# EAGLE design Diagrama_primário (EAGLE 9.4.2)
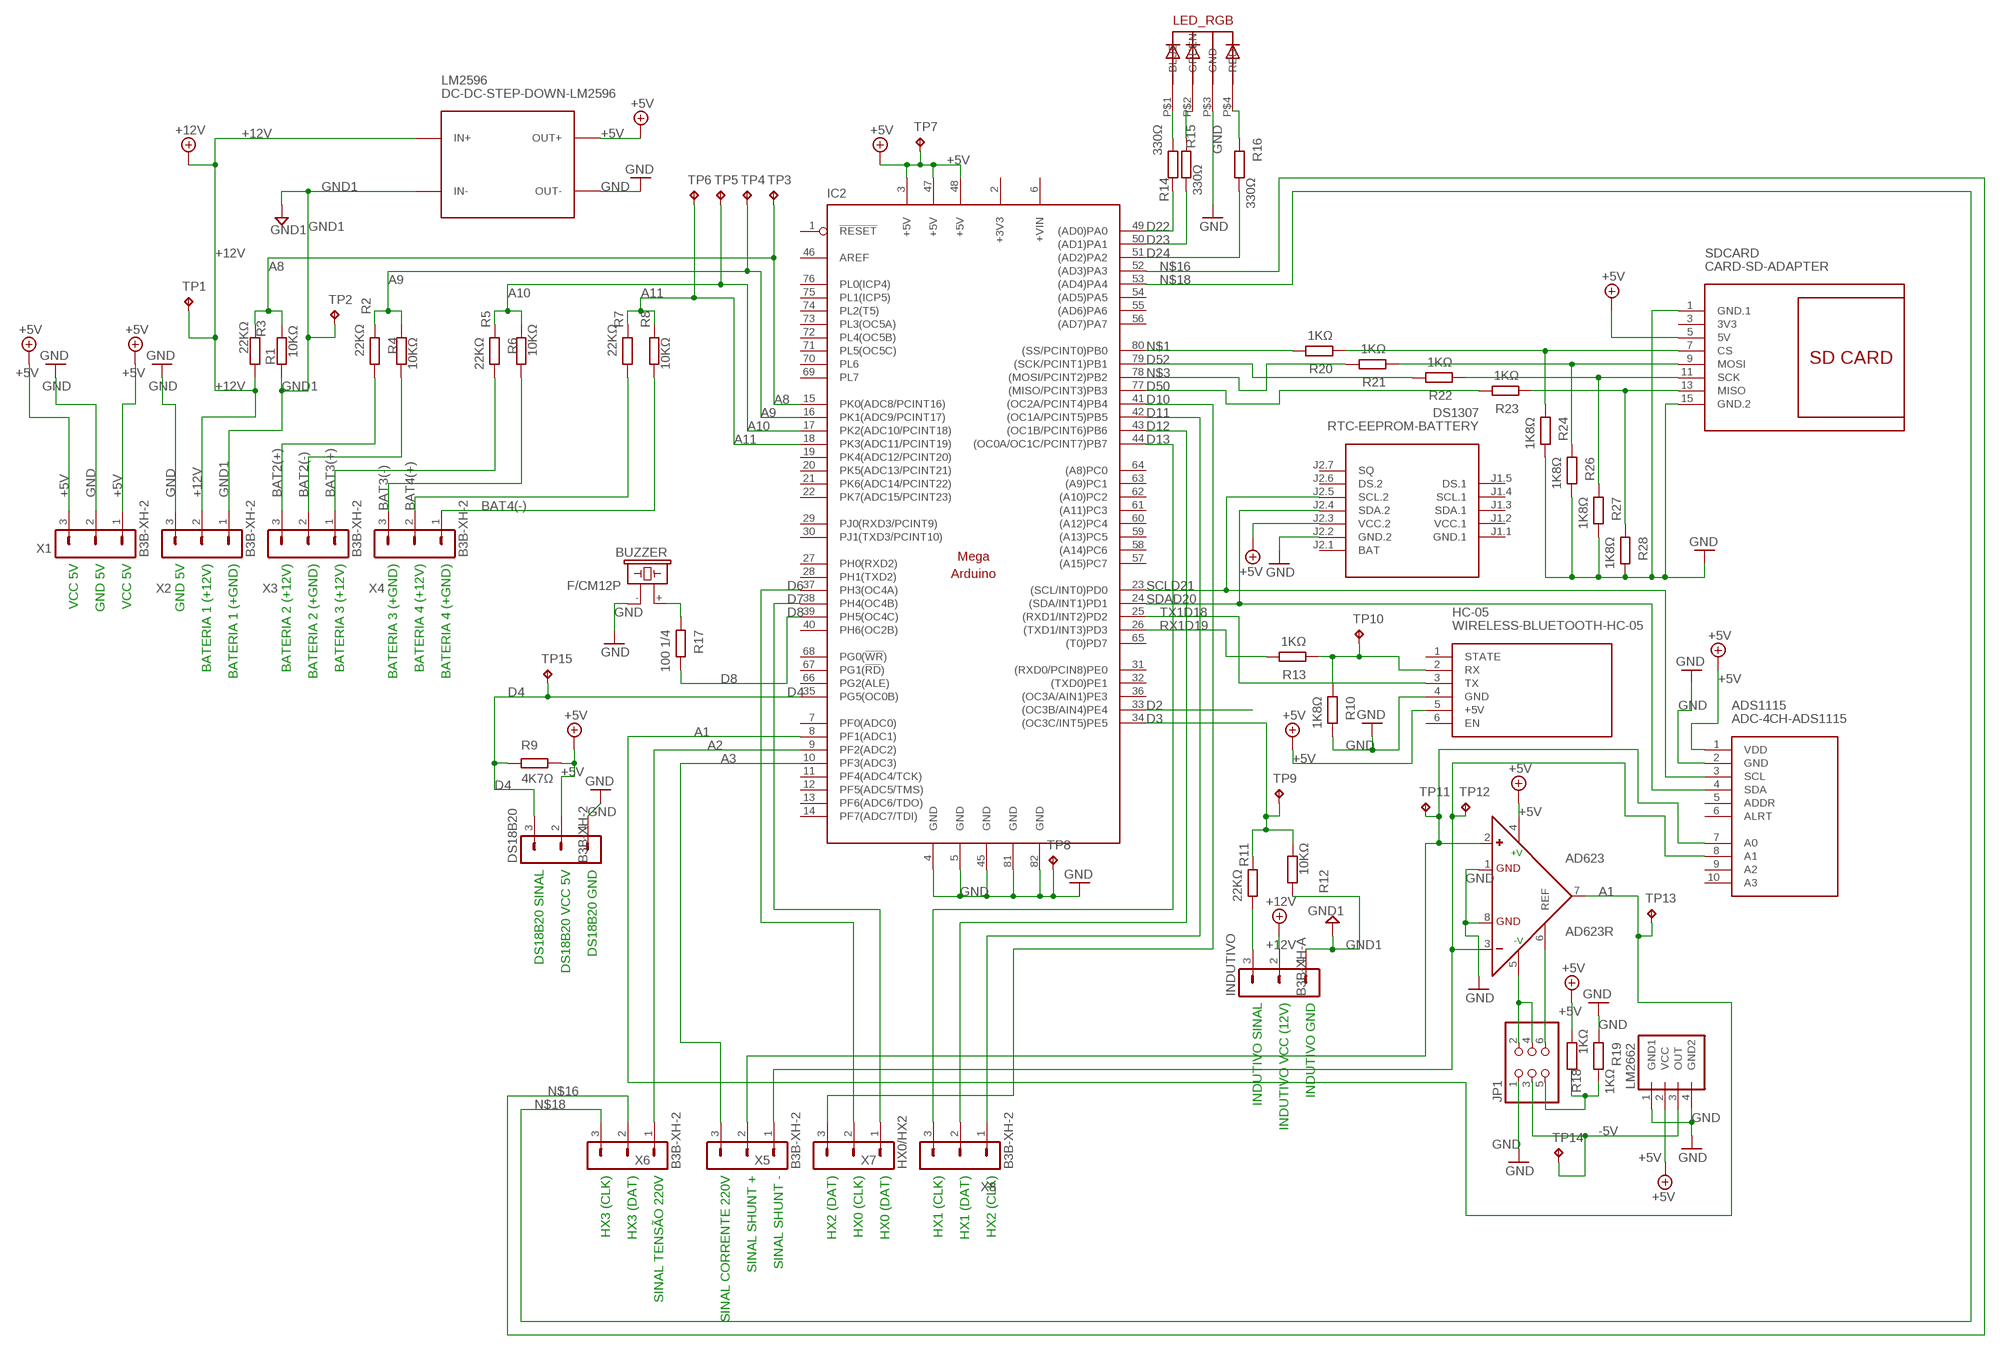
[diagram p0: schematic, sheet 1]

## Parts
AD623  AD623R  [SO8]
ADS1115  ADC-4CH-ADS1115  [ADC-4CH-ADS1115]
BUZZER  F/CM12P  [F/CM12P]
DS18B20  B3B-XH-2  [B3B-XH-A]
DS1307  RTC-EEPROM-BATTERY  [RTC-EEPROM-BATTERY]
HC-05  WIRELESS-BLUETOOTH-HC-05  [WIRELESS-BLUETOOTH-HC-05]
IC2  MEGAARDUINO_11  [MEGA_ARDUINO_1]
INDUTIVO  B3B-XH-A  [B3B-XH-A]
JP1  PINHD-2X3  [2X03]
LED_RGB  5MMRGBLED  [LED5MMRGB]
LM2596  DC-DC-STEP-DOWN-LM2596  [DC-DC-STEP-DOWN-LM2596]
LM2662  LM2662  [LM2662]
R1  10KΩ  1K1/4RESISTOR  [1/4W-0.41K]
R2  22KΩ  1K1/4RESISTOR  [1/4W-0.41K]
R3  22KΩ  1K1/4RESISTOR  [1/4W-0.41K]
R4  10KΩ  1K1/4RESISTOR  [1/4W-0.41K]
R5  22KΩ  1K1/4RESISTOR  [1/4W-0.41K]
R6  10KΩ  1K1/4RESISTOR  [1/4W-0.41K]
R7  22KΩ  1K1/4RESISTOR  [1/4W-0.41K]
R8  10KΩ  1K1/4RESISTOR  [1/4W-0.41K]
R9  4K7Ω  1K1/4RESISTOR  [1/4W-0.41K]
R10  1K8Ω  1K1/4RESISTOR  [1/4W-0.41K]
R11  22KΩ  1K1/4RESISTOR  [1/4W-0.41K]
R12  10KΩ  1K1/4RESISTOR  [1/4W-0.41K]
R13  1KΩ  1K1/4RESISTOR  [1/4W-0.41K]
R14  330Ω  1K1/4RESISTOR  [1/4W-0.41K]
R15  330Ω  1K1/4RESISTOR  [1/4W-0.41K]
R16  330Ω  1K1/4RESISTOR  [1/4W-0.41K]
R17  100 1/4  1K1/4RESISTOR  [1/4W-0.41K]
R18  1KΩ  1K1/4RESISTOR  [1/4W-0.41K]
R19  1KΩ  1K1/4RESISTOR  [1/4W-0.41K]
R20  1KΩ  1K1/4RESISTOR  [1/4W-0.41K]
R21  1KΩ  1K1/4RESISTOR  [1/4W-0.41K]
R22  1KΩ  1K1/4RESISTOR  [1/4W-0.41K]
R23  1KΩ  1K1/4RESISTOR  [1/4W-0.41K]
R24  1K8Ω  1K1/4RESISTOR  [1/4W-0.41K]
R26  1K8Ω  1K1/4RESISTOR  [1/4W-0.41K]
R27  1K8Ω  1K1/4RESISTOR  [1/4W-0.41K]
R28  1K8Ω  1K1/4RESISTOR  [1/4W-0.41K]
SDCARD  CARD-SD-ADAPTER  [CARD-SD-ADAPTER]
TP1  TPB1,27  [B1,27]
TP2  TPB1,27  [B1,27]
TP3  TPB1,27  [B1,27]
TP4  TPB1,27  [B1,27]
TP5  TPB1,27  [B1,27]
TP6  TPB1,27  [B1,27]
TP7  TPB1,27  [B1,27]
TP8  TPB1,27  [B1,27]
TP9  TPB1,27  [B1,27]
TP10  TPB1,27  [B1,27]
TP11  TPB1,27  [B1,27]
TP12  TPB1,27  [B1,27]
TP13  TPB1,27  [B1,27]
TP14  TPB1,27  [B1,27]
TP15  TPB1,27  [B1,27]
X1  B3B-XH-2  [B3B-XH-A]
X2  B3B-XH-2  [B3B-XH-A]
X3  B3B-XH-2  [B3B-XH-A]
X4  B3B-XH-2  [B3B-XH-A]
X5  B3B-XH-2  [B3B-XH-A]
X6  B3B-XH-2  [B3B-XH-A]
X7  HX0/HX2  B3B-XH-2  [B3B-XH-A]
X8  B3B-XH-2  [B3B-XH-A]

## Nets
+5V: AD623.4(+V) ADS1115.1(VDD) DS18B20.2 DS1307.J2.3(VCC.2) HC-05.5(+5V) IC2.3(+5V) IC2.47(+5V) IC2.48(+5V) LM2596.OUT+ LM2662.2(VCC) R9.2 R18.1 SDCARD.5(5V) TP7.TP X1.1 X1.3
+12V: INDUTIVO.2 LM2596.IN+ R3.2 TP1.TP X2.2
-5V: JP1.3 LM2662.3(OUT) TP14.TP
A1: AD623.7(OUT) IC2.8(PF1(ADC1)) TP13.TP
A2: IC2.9(PF2(ADC2)) X6.1
A3: IC2.10(PF3(ADC3)) X5.3
A8: IC2.15(PK0(ADC8/PCINT16)) R1.1 R3.1 TP3.TP
A9: IC2.16(PK1(ADC9/PCINT17)) R2.1 R4.1 TP4.TP
A10: IC2.17(PK2(ADC10/PCINT18)) R5.1 R6.1 TP5.TP
A11: IC2.18(PK3(ADC11/PCINT19)) R7.1 R8.1 TP6.TP
BAT2(+): R2.2 X3.3
BAT2(-): R4.2 X3.2
BAT3(+): R5.2 X3.1
BAT3(-): R6.2 X4.3
BAT4(+): R7.2 X4.2
BAT4(-): R8.2 X4.1
D2: IC2.33((OC3B/AIN4)PE4)
D3: IC2.34((OC3C/INT5)PE5) R11.1 R12.1 TP9.TP
D4: DS18B20.3 IC2.35(PG5(OC0B)) R9.1 TP15.TP
D6: IC2.37(PH3(OC4A)) X7.2
D7: IC2.38(PH4(OC4B)) X7.1
D8: IC2.39(PH5(OC4C)) R17.2
D10: IC2.41((OC2A/PCINT4)PB4) X7.3
D11: IC2.42((OC1A/PCINT5)PB5) X8.1
D12: IC2.43((OC1B/PCINT6)PB6) X8.2
D13: IC2.44((OC0A/OC1C/PCINT7)PB7) X8.3
D22: IC2.49((AD0)PA0) R14.2
D23: IC2.50((AD1)PA1) R15.2
D24: IC2.51((AD2)PA2) R16.2
D50: IC2.77((MISO/PCINT3)PB3) R23.2
D51: R21.1 R26.1 SDCARD.9(MOSI)
D52: IC2.79((SCK/PCINT1)PB1) R22.2
D53: R20.1 R24.1 SDCARD.7(CS)
GND: AD623.1(RG) AD623.8(RG) ADS1115.2(GND) BUZZER.- DS18B20.1 DS1307.J2.2(GND.2) HC-05.4(GND) IC2.4(GND) IC2.5(GND) IC2.45(GND) IC2.81(GND) IC2.82(GND) JP1.1 LED_RGB.P$3(GND) LM2596.OUT- LM2662.1(GND1) LM2662.4(GND2) R10.2 R19.1 R24.2 R26.2 R27.2 R28.2 SDCARD.1(GND.1) SDCARD.15(GND.2) TP8.TP X1.2 X2.3
GND1: INDUTIVO.1 LM2596.IN- R1.2 R12.2 TP2.TP X2.1
N$1: IC2.80((SS/PCINT0)PB0) R20.2
N$2: INDUTIVO.3 R11.2
N$3: IC2.78((MOSI/PCINT2)PB2) R21.2
N$8: HC-05.2(RX) R10.1 R13.1 TP10.TP
N$11: LED_RGB.P$1(BLUE) R14.1
N$12: LED_RGB.P$2(GREEN) R15.1
N$13: LED_RGB.P$4(RED) R16.1
N$14: R22.1 R27.1 SDCARD.11(SCK)
N$15: R23.1 R28.1 SDCARD.13(MISO)
N$16: IC2.52((AD3)PA3) X6.2
N$17: BUZZER.+ R17.1
N$18: IC2.53((AD4)PA4) X6.3
N$25: AD623.3(-) ADS1115.8(A1) TP12.TP X5.1
N$26: AD623.2(+) ADS1115.7(A0) TP11.TP X5.2
N$27: AD623.5(-V) JP1.2 JP1.4
N$28: AD623.6(REF) JP1.6
RX1D19: IC2.26((TXD1/INT3)PD3) R13.2
SCLD21: ADS1115.3(SCL) DS1307.J2.5(SCL.2) IC2.23((SCL/INT0)PD0)
SDAD20: ADS1115.4(SDA) DS1307.J2.4(SDA.2) IC2.24((SDA/INT1)PD1)
TX1D18: HC-05.3(TX) IC2.25((RXD1/INT2)PD2)
VCC1: JP1.5 R18.2 R19.2
Unconnected: ADS1115.5(ADDR) ADS1115.6(ALRT) ADS1115.9(A2) ADS1115.10(A3) DS1307.J1.3(SDA.1) DS1307.J1.4(SCL.1) DS1307.J1.5(DS.1) DS1307.J2.1(BAT) DS1307.J2.6(DS.2) DS1307.J2.7(SQ) HC-05.1(STATE) HC-05.6(EN) IC2.1(!RESET) IC2.7(PF0(ADC0)) IC2.11(PF4(ADC4/TCK)) IC2.12(PF5(ADC5/TMS)) IC2.13(PF6(ADC6/TDO)) IC2.14(PF7(ADC7/TDI)) IC2.19(PK4(ADC12/PCINT20)) IC2.20(PK5(ADC13/PCINT21)) IC2.21(PK6(ADC14/PCINT22)) IC2.22(PK7(ADC15/PCINT23)) IC2.27(PH0(RXD2)) IC2.28(PH1(TXD2)) IC2.29(PJ0(RXD3/PCINT9)) IC2.30(PJ1(TXD3/PCINT10)) IC2.31((RXD0/PCIN8)PE0) IC2.32((TXD0)PE1) IC2.36((OC3A/AIN1)PE3) IC2.40(PH6(OC2B)) IC2.46(AREF) IC2.54((AD5)PA5) IC2.55((AD6)PA6) IC2.56((AD7)PA7) IC2.57((A15)PC7) IC2.58((A14)PC6) IC2.59((A13)PC5) IC2.60((A12)PC4) IC2.61((A11)PC3) IC2.62((A10)PC2) IC2.63((A9)PC1) IC2.64((A8)PC0) IC2.65((T0)PD7) IC2.66(PG2(ALE)) IC2.67(PG1(!RD!)) IC2.68(PG0(!WR!)) IC2.69(PL7) IC2.70(PL6) IC2.71(PL5(OC5C)) IC2.72(PL4(OC5B)) IC2.73(PL3(OC5A)) IC2.74(PL2(T5)) IC2.75(PL1(ICP5)) IC2.76(PL0(ICP4))

## Notes on the sheet
- VCC 5V | GND 5V | VCC 5V | GND 5V | BATERIA 1 (+12V) | BATERIA 1 (+GND) | BATERIA 2 (+12V) | BATERIA 2 (+GND) | BATERIA 3 (+12V) | BATERIA 3 (+GND) | BATERIA 4 (+12V) | BATERIA 4 (+GND)
- DS18B20 SINAL | DS18B20 VCC 5V | DS18B20 GND
- INDUTIVO SINAL | INDUTIVO VCC (12V) | INDUTIVO GND
- HX3 (CLK) | HX3 (DAT) | SINAL TENSÃO 220V | SINAL CORRENTE 220V | SINAL SHUNT + | SINAL SHUNT - | HX2 (DAT) | HX0 (CLK) | HX0 (DAT) | HX1 (CLK) | HX1 (DAT) | HX2 (CLK)

## Power pins joined to a net without a drawn wire
3V3: SDCARD.3(3V3)
+3V3: IC2.2(+3V3)
+VIN: IC2.6(+VIN)
GND.1: DS1307.J1.1(GND.1)
VCC.1: DS1307.J1.2(VCC.1)

## Library data of the parts
AD623 = minha biblioteca:AD623: Single-Supply, Rail-to-Rail, Low Cost Instrumentation Amplifier Source: http://www.analog.com/static/imported-files/data_sheets/AD623.pdf; MPN: AD623ARZ.; OC_FARNELL: 9426213; OC_NEWARK: 31M4186
ADS1115 = diy-modules:ADC-4CH-ADS1115: 4 Channel 16-Bit Analog-to-Digital Converter based on ADS1115 chip Arduino ADS1115 Getting Started Tutorial is available here: http://henrysbench.capnfatz.com/henrys-bench/arduino-voltage-measurements/arduino-ads1115-module-getting-started-tutorial/ ADS1115 datasheet is available here: http://www.ti.com/lit/ds/symlink/ads1115.pdf Click here to find device on ebay.com <http://www.ebay.com/sch/ads1115+module>
BUZZER = buzzer:F/CM12P: BUZZER Source: Buerklin; OC_FARNELL: unknown; OC_NEWARK: unknown
DS18B20 INDUTIVO X1-X8 = con-JST XH:B3B-XH: JST XH series header 2.50mm pitch disconnectable crimp style connectors, vertical (side entry type), 3 pins
DS1307 = diy-modules:RTC-EEPROM-BATTERY: RTC Module with Battery and EEPROM based on DS1307 and AT24C32 chips More details available here: http://henrysbench.capnfatz.com/henrys-bench/arduino-sensors-and-input/arduino-tiny-rtc-d1307-tutorial/ Click here to find device on ebay.com <http://www.ebay.com/sch/tiny+rtc+arduino>
HC-05 = diy-modules:WIRELESS-BLUETOOTH-HC-05: Bluetooth Transceiver Module based on HC-05 board Tutorial is available here: https://arduino-info.wikispaces.com/BlueTooth-HC05-HC06-Modules-How-To Click here to find device on ebay.com <http://www.ebay.com/sch/hc-05+module+rs232>
IC2 = minha biblioteca:MEGAARDUINO_1: The Arduino Mega is a microcontroller board based on the ATmega1280. - 54 digital input/output pins (of which 14 can be used as PWM outputs) - 16 analog inputs - 4 UARTs (hardware serial ports) - 16 MHz crystal oscillator - USB connection - power jack - ICSP header - reset button It contains everything needed to support the microcontroller; simply connect it to a computer with a USB cable or power it with a AC-to-DC adapter or battery to get started. The Mega is compatible with most shields designed for the Arduino Duemilanove or Diecimila. http://arduino.cc/en/Main/ArduinoBoardMega
JP1 = pinhead:PINHD-2X3: PIN HEADER
LED_RGB = minha biblioteca:5MMRGBLED
LM2596 = diy-modules:DC-DC-STEP-DOWN-LM2596: DC/DC Step-Down Regulator based on LM2596-ADJ chip LM2596 datasheet available here: http://www.ti.com/lit/ds/symlink/lm2596.pdf Click here to find device on ebay.com <http://www.ebay.com/sch/lm2596+power+regulator>
LM2662 = minha biblioteca:LM2662: PIN HEADER
R1-R24 R26-R28 = resistors:1K1/4RESISTOR
SDCARD = diy-modules:CARD-SD-ADAPTER: Full Size SD Card Adapter Module with onboard 3.3V regulator Guide describing how to use SD card with Arduino is available here: https://www.arduino.cc/en/Reference/SDCardNotes Click here to find device on ebay.com <http://www.ebay.com/sch/sd+card+socket+module>
TP1-TP15 = testpad:TP: Test pad

## Board
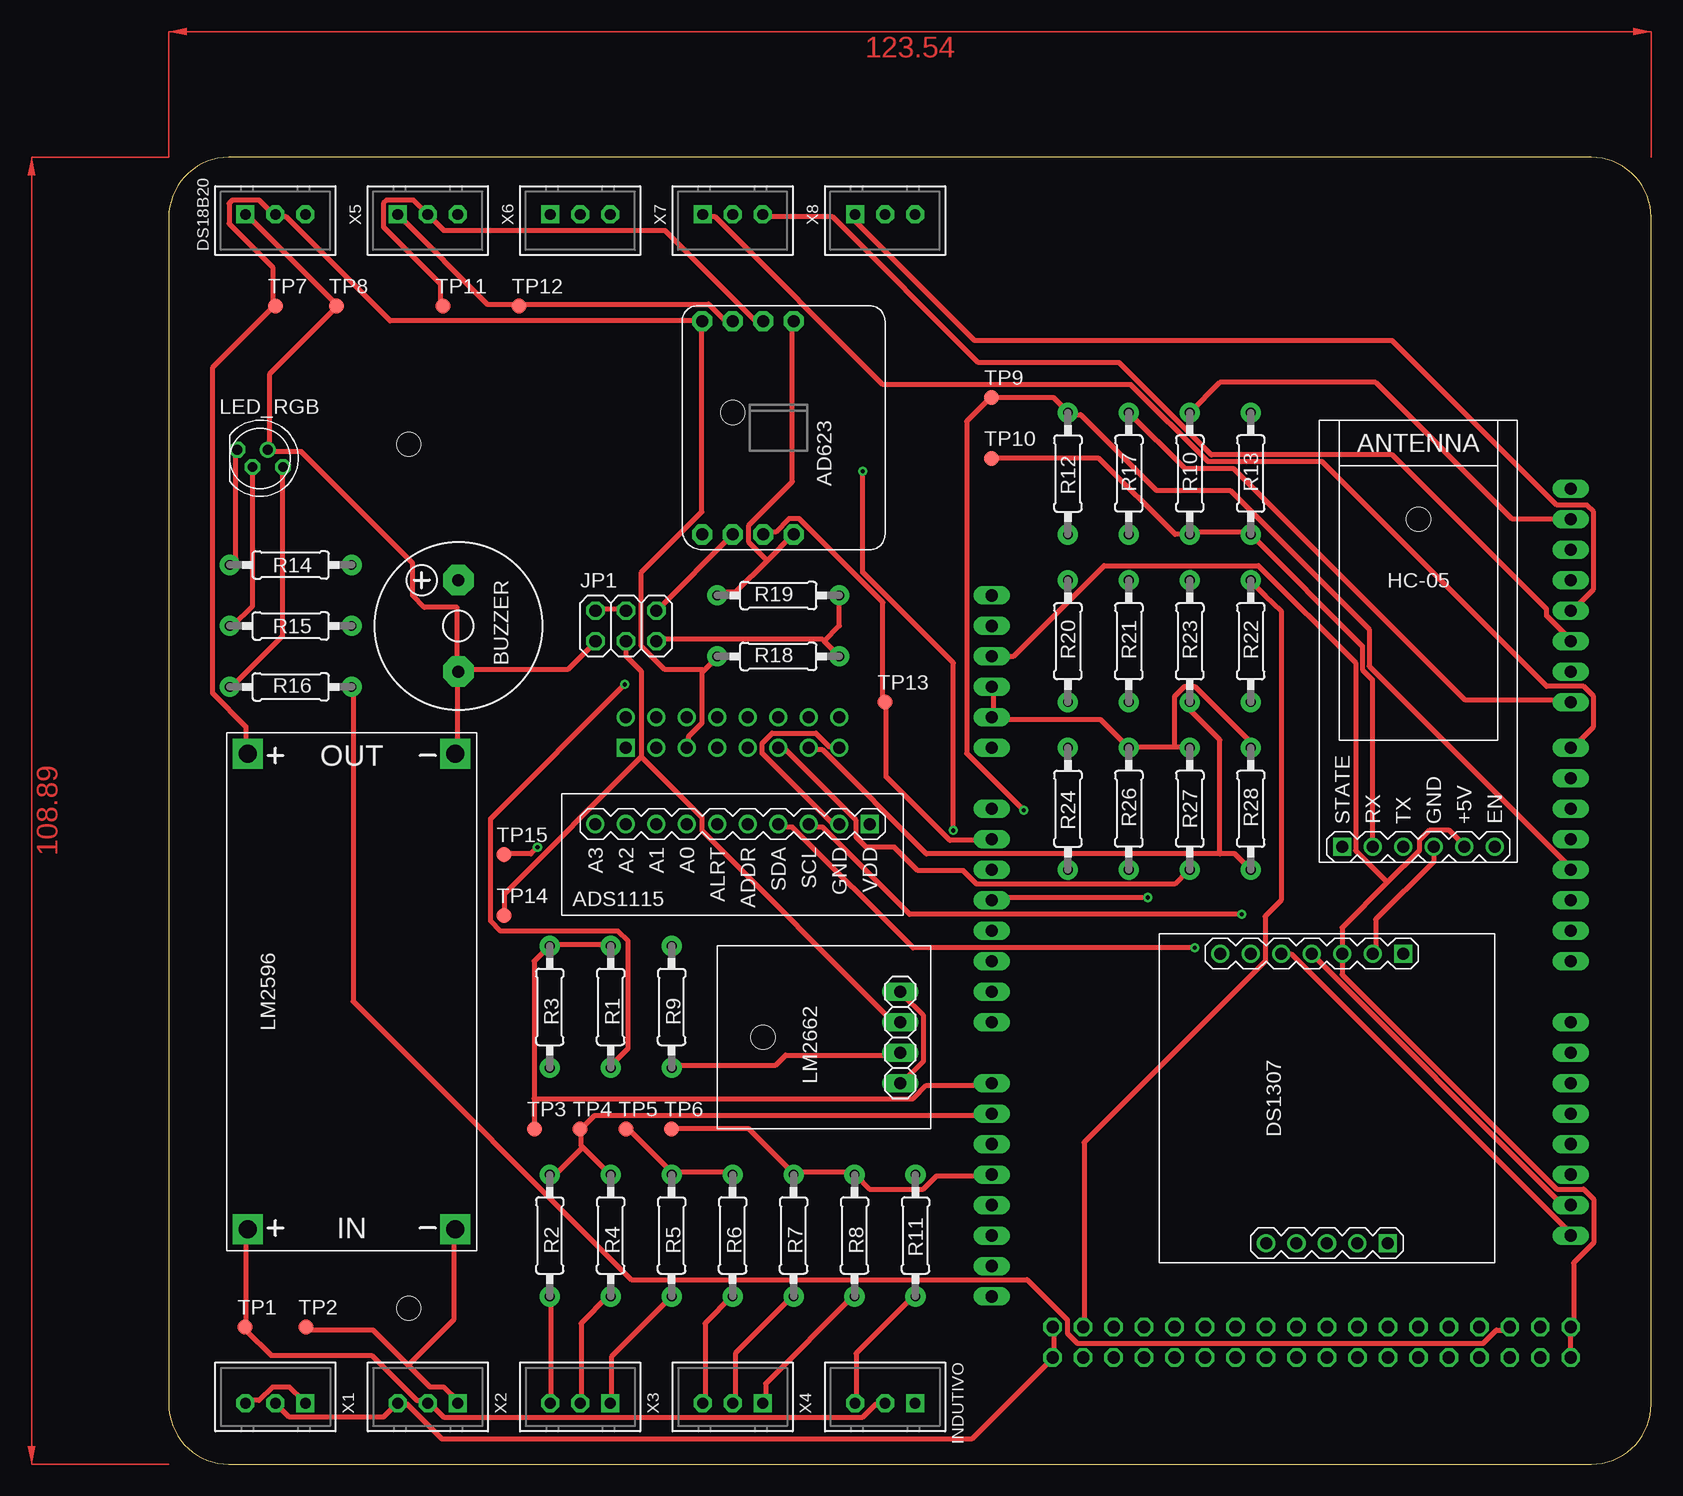
[diagram p1: board, top side]
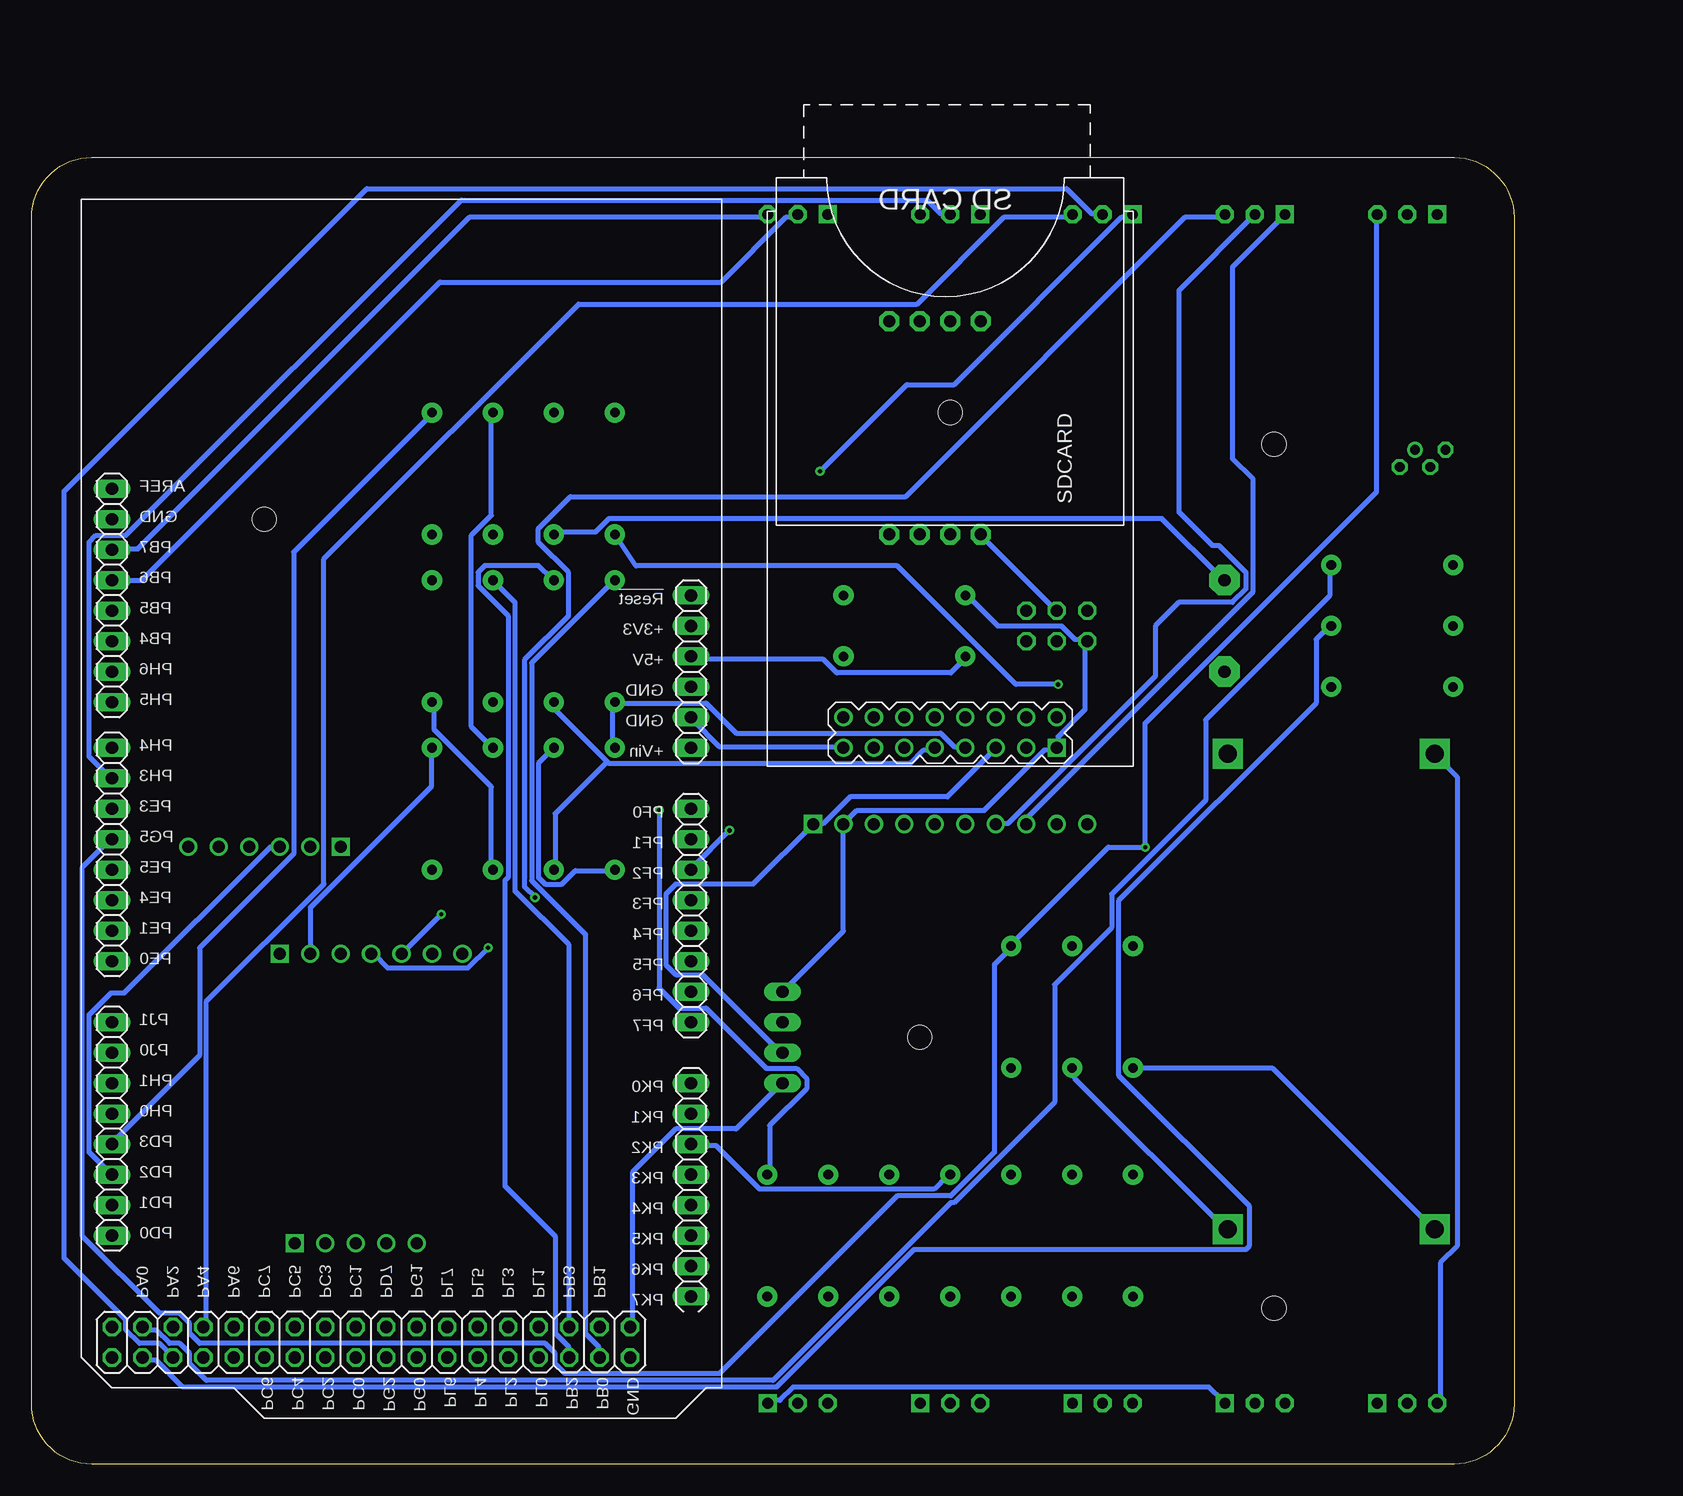
[diagram p2: board, bottom side, seen from below]

Size 123.54 x 108.89 mm. Coordinates in mm from the lower left corner, seen from the top.
Outline: 0,103.89 0,5 arc90 5,0 118.54,0 arc90 123.54,5 123.54,103.89 arc90 118.54,108.89 5,108.89 arc90 0,103.89
Copper layers (1*16): Top 0.035mm / dielectric 1.5mm / Bottom 0.035mm
Design rules "default *": minimum track width 16mil, minimum drill 0.35mm, track to track 6mil, track to pad 6mil, pad to pad 6mil, via to via 6mil, smd to smd 6mil, copper to edge 40mil, drill to drill 6mil, minimum pad ring 10mil, minimum via ring 8mil, stop-mask expansion 4mil, vias tented up to drill 0mil, thermal gap 10mil
Holes 2 mm at 20,85 20,13

### Footprints (pad centres in the part's own frame; a part is rotated, then mirrored left to right if it is on the bottom)
SO8 = drill 1 pad 1.676 octagon: 1 -1.27,-10.16; 2 1.27,-10.16; 3 3.81,-10.16; 4 6.35,-10.16; 5 6.35,7.62; 6 3.81,7.62; 7 1.27,7.62; 8 -1.27,7.62
ADC-4CH-ADS1115 = drill 1 square: 1 -6.35,11.43 | drill 1: 2 -6.35,8.89; 3 -6.35,6.35; 4 -6.35,3.81; 5 -6.35,1.27; 6 -6.35,-1.27; 7 -6.35,-3.81; 8 -6.35,-6.35; 9 -6.35,-8.89; 10 -6.35,-11.43
F/CM12P = drill 1.016 pad 2.54 octagon: + 3.81,0; - -3.81,0
B3B-XH-A = drill 0.9 pad 1.5 square: 1 2.5,0 | drill 0.9 pad 1.5 octagon: 2 0,0; 3 -2.5,0
RTC-EEPROM-BATTERY = drill 1 square: J1.1 -12.065,-5.08; J2.1 12.065,-6.35 | drill 1: J1.2 -12.065,-2.54; J1.3 -12.065,0; J1.4 -12.065,2.54; J1.5 -12.065,5.08; J2.2 12.065,-3.81; J2.3 12.065,-1.27; J2.4 12.065,1.27; J2.5 12.065,3.81; J2.6 12.065,6.35; J2.7 12.065,8.89
WIRELESS-BLUETOOTH-HC-05 = drill 1 square: 1 -6.35,-17.145 | drill 1: 2 -3.81,-17.145; 3 -1.27,-17.145; 4 1.27,-17.145; 5 3.81,-17.145; 6 6.35,-17.145 | hole 2: 0,10.16
MEGA_ARDUINO_1 = drill 1.016 long: 1 33.02,2.54; 2 35.56,2.54; 3 38.1,2.54; 4 40.64,2.54; 5 43.18,2.54; 6 45.72,2.54; 7 50.8,2.54; 8 53.34,2.54; 9 55.88,2.54; 10 58.42,2.54; 11 60.96,2.54; 12 63.5,2.54; 13 66.04,2.54; 14 68.58,2.54; 15 73.66,2.54; 16 76.2,2.54; 17 78.74,2.54; 18 81.28,2.54; 19 83.82,2.54; 20 86.36,2.54; 21 88.9,2.54; 22 91.44,2.54; 23 86.36,50.8; 24 83.82,50.8; 25 81.28,50.8; 26 78.74,50.8; 27 76.2,50.8; 28 73.66,50.8; 29 71.12,50.8; 30 68.58,50.8; 31 63.5,50.8; 32 60.96,50.8; 33 58.42,50.8; 34 55.88,50.8; 35 53.34,50.8; 36 50.8,50.8; 37 48.26,50.8; 38 45.72,50.8; 39 41.91,50.8; 40 39.37,50.8; 41 36.83,50.8; 42 34.29,50.8; 43 31.75,50.8; 44 29.21,50.8; 45 26.67,50.8; 46 24.13,50.8 | drill 1.016 octagon: 47 93.98,50.8; 48 96.52,50.8; 49 93.98,48.26; 50 96.52,48.26; 51 93.98,45.72; 52 96.52,45.72; 53 93.98,43.18; 54 96.52,43.18; 55 93.98,40.64; 56 96.52,40.64; 57 93.98,38.1; 58 96.52,38.1; 59 93.98,35.56; 60 96.52,35.56; 61 93.98,33.02; 62 96.52,33.02; 63 93.98,30.48; 64 96.52,30.48; 65 93.98,27.94; 66 96.52,27.94; 67 93.98,25.4; 68 96.52,25.4; 69 93.98,22.86; 70 96.52,22.86; 71 93.98,20.32; 72 96.52,20.32; 73 93.98,17.78; 74 96.52,17.78; 75 93.98,15.24; 76 96.52,15.24; 77 93.98,12.7; 78 96.52,12.7; 79 93.98,10.16; 80 96.52,10.16; 81 93.98,7.62; 82 96.52,7.62
2X03 = drill 1.016 octagon: 1 -2.54,-1.27; 2 -2.54,1.27; 3 0,-1.27; 4 0,1.27; 5 2.54,-1.27; 6 2.54,1.27
LED5MMRGB = drill 0.8 pad 0.813 octagon: P$1 -1.905,0.714; P$2 -0.635,-0.714; P$4 1.905,-0.714 | drill 0.8 pad 0.813: P$3 0.635,0.714
DC-DC-STEP-DOWN-LM2596 = drill 1.5 pad 2.5 square: IN+ -19.812,8.636; IN- -19.812,-8.636; OUT+ 19.812,8.636; OUT- 19.812,-8.636
LM2662 = drill 1.016 long: 1 -3.81,0; 2 -1.27,0; 3 1.27,0; 4 3.81,0 | hole 2: 0,11.43
1/4W-0.41K = drill 0.813 pad 1.676: 1 -5.08,0; 2 5.08,0
CARD-SD-ADAPTER = drill 1 square: 1 -21.59,8.89 | drill 1: 2 -19.05,8.89; 3 -21.59,6.35; 4 -19.05,6.35; 5 -21.59,3.81; 6 -19.05,3.81; 7 -21.59,1.27; 8 -19.05,1.27; 9 -21.59,-1.27; 10 -19.05,-1.27; 11 -21.59,-3.81; 12 -19.05,-3.81; 13 -21.59,-6.35; 14 -19.05,-6.35; 15 -21.59,-8.89; 16 -19.05,-8.89 | hole 2: 6.35,0
B1,27 = smd 1.27 x 1.27: TP 0,0

### Placement (x,y rotation side)
AD623  50.8,85.09 180 top
ADS1115  46.99,46.99 270 top
BUZZER  24.13,69.85 90 top
DS18B20  8.89,104.14 180 top
DS1307  96.52,30.48 90 top
HC-05  104.14,68.58 0 top
IC2  66.04,105.41 270 top
INDUTIVO  59.69,5.08 0 top
JP1  38.1,69.85 0 top
LED_RGB  7.62,83.82 0 top
LM2596  15.24,39.37 90 top
LM2662  60.96,35.56 90 top
R1  36.83,38.1 270 top
R2  31.75,19.05 270 top
R3  31.75,38.1 270 top
R4  36.83,19.05 270 top
R5  41.91,19.05 270 top
R6  46.99,19.05 270 top
R7  52.07,19.05 270 top
R8  57.15,19.05 270 top
R9  41.91,38.1 270 top
R10  85.09,82.55 90 top
R11  62.23,19.05 270 top
R12  74.93,82.55 270 top
R13  90.17,82.55 90 top
R14  10.16,74.93 0 top
R15  10.16,69.85 0 top
R16  10.16,64.77 0 top
R17  80.01,82.55 90 top
R18  50.8,67.31 0 top
R19  50.8,72.39 0 top
R20  74.93,68.58 90 top
R21  80.01,68.58 90 top
R22  90.17,68.58 90 top
R23  85.09,68.58 90 top
R24  74.93,54.61 270 top
R26  80.01,54.61 90 top
R27  85.09,54.61 90 top
R28  90.17,54.61 90 top
SDCARD  46.99,81.28 90 top
TP1  6.35,11.43 0 top
TP2  11.43,11.43 0 top
TP3  30.48,27.94 0 top
TP4  34.29,27.94 0 top
TP5  38.1,27.94 0 top
TP6  41.91,27.94 0 top
TP7  8.89,96.52 0 top
TP8  13.97,96.52 0 top
TP9  68.58,88.9 0 top
TP10  68.58,83.82 0 top
TP11  22.86,96.52 0 top
TP12  29.21,96.52 0 top
TP13  59.69,63.5 0 top
TP14  27.94,45.72 0 top
TP15  27.94,50.8 0 top
X1  8.89,5.08 0 top
X2  21.59,5.08 0 top
X3  34.29,5.08 0 top
X4  46.99,5.08 0 top
X5  21.59,104.14 180 top
X6  34.29,104.14 180 top
X7  46.99,104.14 180 top
X8  59.69,104.14 180 top

### Tracks (layer width: path | path; a pad name or v marks a point on that pad's centre or on a via)
+5V
  Top 0.406: X1.3 6.43,5.31 7.54,5.31 8.66,6.43 10.06,6.43 11.18,5.31 X1.1 | IC2.48 116.79,8.94 116.79,11.18 IC2.47 117.07,11.46 117.07,16.76 118.75,18.44 118.75,22.07 117.91,22.91 115.67,22.91 97.79,40.79 DS1307.J2.3 97.79,44.7 101.56,48.48 | 101.56,48.48 104.22,51.13 104.22,51.97 105.05,52.81 106.73,52.81 107.85,51.69 HC-05.5 | LM2662.2 60.91,34.09 51.41,34.09 50.57,33.25 41.91,33.25 R9.2 | 44.56,66.08 45.54,67.06 R18.1 | 44.56,66.08 44.42,65.94 44.42,61.75 43.31,60.63 43.31,59.79 SDCARD.5 | 44.56,66.08 44.42,66.22 41.35,66.22 39.4,68.17 39.4,74.32 44.42,79.35 44.42,95 AD623.4 44.42,95.28 18.44,95.28 9.78,103.94 8.94,103.94 DS18B20.2 8.66,104.22 7.54,105.33 5.31,105.33 5.03,105.05 5.03,103.38 8.66,99.75 8.66,96.67 TP7.TP 8.66,96.39 3.63,91.36 3.63,64.26 6.43,61.47 6.43,59.23 LM2596.OUT+ | 101.56,48.48 98.91,51.13 98.91,66.78 90.81,74.88 77.95,74.88 70.41,67.33 68.73,67.33 IC2.3
  Bottom 0.406: X1.3 6.15,5.31 6.15,16.76 4.75,18.16 4.75,57.28 6.43,58.95 LM2596.OUT+ | SDCARD.5 43.31,59.51 47.22,55.6 55.32,55.6 57.56,53.37 58.4,53.37 ADS1115.1 63.42,48.34 69.85,48.34 70.69,47.5 70.69,41.63 69.85,40.79 67.61,40.79 61.19,34.37 LM2662.2 | IC2.3 68.45,67.06 57.56,67.06 56.44,65.94 46.94,65.94 45.82,67.06 R18.1
+12V
  Top 0.406: LM2596.IN+ 6.43,19.56 6.43,11.46 TP1.TP 6.43,11.18 8.53,9.07 16.92,9.07 20.68,5.31 21.51,5.31 X2.2 21.79,5.03 22.91,3.91 57.84,3.91 58.95,5.03 59.51,5.03 INDUTIVO.2
  Bottom 0.406: R3.2 31.57,32.97 20.12,32.97 6.71,19.56 LM2596.IN+
-5V
  Top 0.406: TP14.TP 27.94,47.5 39.4,58.95 | 39.4,58.95 39.4,66.06 38.1,67.36 JP1.3 | 39.4,58.95 44.42,53.92 44.42,52.81 60.35,36.88 60.91,36.88 LM2662.3
A1
  Top 0.406: IC2.8 68.45,51.97 65.1,51.97 59.79,57.28 59.79,63.42 TP13.TP 59.51,63.7 59.51,71.81 52.53,78.79 51.69,78.79 50.57,77.67 49.73,77.67 AD623.7
A2  (via drill 0.35)
  Top 0.406: v57.84,82.73 57.84,74.32 65.38,66.78 v65.38,52.81
  Bottom 0.406: v57.84,82.73 50.6,89.97 46.66,89.97 32.69,103.94 31.85,103.94 X6.1 | v65.38,52.81 68.45,49.73 IC2.9
A3  (via drill 0.35)
  Top 0.406: v81.58,47.22 68.73,47.22 IC2.10
  Bottom 0.406: v81.58,47.22 82.42,48.06 82.42,67.06 78.79,70.69 78.79,74.32 81.31,76.83 81.31,77.95 78.64,80.62 50.7,80.62 27.38,103.94 24.31,103.94 X5.3
A8
  Top 0.406: 30.45,30.45 30.45,41.91 31.57,43.03 R3.1 31.85,43.31 36.6,43.31 R1.1 | 30.45,30.45 30.45,27.94 TP3.TP | 30.45,30.45 62.03,30.45 63.14,31.57 68.45,31.57 IC2.15
A9
  Top 0.406: 34.37,27.94 34.37,26.54 34.51,26.4 | 34.51,26.4 36.6,24.31 R4.1 | 34.37,27.94 35.48,29.06 68.45,29.06 IC2.16 | 34.37,27.94 TP4.TP | 34.51,26.4 32.41,24.31 31.85,24.31 R2.1
A10
  Top 0.406: 41.91,24.31 38.28,27.94 TP5.TP | 41.91,24.31 46.94,24.31 R6.1 | 41.91,24.31 R5.1
  Bottom 0.406: IC2.17 68.45,26.54 66.5,26.54 62.87,22.91 48.34,22.91 47.22,24.03 R6.1
A11
  Top 0.406: TP6.TP 48.34,27.94 51.97,24.31 R7.1 52.25,24.31 57,24.31 R8.1 57.28,24.03 58.4,22.91 62.87,22.91 63.98,24.03 68.45,24.03 IC2.18
BAT2(+)
  Top 0.406: X3.3 31.85,5.31 31.85,13.97 R2.2
BAT2(-)
  Top 0.406: X3.2 34.37,5.31 34.37,11.73 36.6,13.97 R4.2
BAT3(+)
  Top 0.406: R5.2 36.88,8.94 36.88,5.31 X3.1
BAT3(-)
  Top 0.406: X4.3 44.7,5.31 44.7,11.73 46.94,13.97 R6.2
BAT4(+)
  Top 0.406: X4.2 47.22,5.31 47.22,9.22 51.97,13.97 R7.2
BAT4(-)
  Top 0.406: X4.1 49.73,5.31 49.73,6.71 57,13.97 R8.2
D3  (via drill 0.35)
  Top 0.406: IC2.34 116.79,49.73 100.03,66.5 100.03,69.57 88.44,81.15 82.3,81.15 76,87.45 75.16,87.45 R12.1 74.88,87.73 73.76,88.85 68.73,88.85 TP9.TP 68.45,88.85 66.5,86.89 66.5,59.23 v71.25,54.48
  Bottom 0.406: v71.25,54.48 71.25,39.67 69.57,38 67.33,38 62.31,32.97 59.79,32.97 58.95,32.13 58.95,31.29 62.03,28.22 62.03,24.31 R11.1
D4  (via drill 0.35)
  Top 0.406: v30.73,51.41 30.18,50.85 27.94,50.85 TP15.TP
  Bottom 0.406: DS18B20.3 11.46,103.94 11.46,81.03 30.73,61.75 v30.73,51.41 33.81,51.41 41.91,43.31 R9.1 41.91,43.03 43.31,41.63 43.31,25.98 46.94,22.35 51.41,22.35 66.22,7.54 79.07,7.54 79.91,8.38 79.91,9.22 80.75,10.06 109.53,10.06 110.36,10.9 110.36,11.73 111.2,12.57 112.88,12.57 119.3,19 119.3,49.73 117.07,51.97 IC2.35
D6
  Bottom 0.406: X7.2 47.22,104.22 47.78,104.22 48.9,105.33 87.73,105.33 115.67,77.39 118.19,77.39 118.75,76.83 118.75,58.95 117.07,57.28 IC2.37
D7
  Top 0.406: X7.1 44.7,103.94 45.54,103.94 59.51,89.97 80.19,89.97 86.61,83.54 96.11,83.54 114.83,64.82 117.91,64.82 118.75,63.98 118.75,61.47 117.07,59.79 IC2.38
D8
  Top 0.406: R17.2 84.66,82.98 88.72,82.98 108,63.7 116.79,63.7 IC2.39
D10
  Top 0.406: X7.3 49.73,103.94 55.32,103.94 67.46,91.8 79.2,91.8 86.89,84.1 101.98,84.1 114.83,71.25 114.83,70.69 116.79,68.73 IC2.41
D11
  Top 0.406: X8.1 57.19,103.59 67.16,93.62 101.96,93.62 115.67,79.91 118.19,79.91 118.75,79.35 118.75,72.92 117.07,71.25 IC2.42
D12
  Bottom 0.406: IC2.43 114.35,73.66 89.51,98.5 66.06,98.5 60.63,103.94 59.79,103.94 X8.2
D13
  Bottom 0.406: X8.3 62.31,103.94 87.02,103.94 114.68,76.28 116.79,76.28 IC2.44
D22
  Bottom 0.406: IC2.49 114.28,11.18 113.16,11.18 112.04,10.06 111.2,10.06 110.36,9.22 110.36,8.38 108.97,6.99 61.75,6.99 46.94,21.79 46.66,21.79 38.28,30.18 38.28,39.95 33.53,44.7 33.53,47.5 25.7,55.32 25.7,62.03 15.37,72.36 15.37,74.88 R14.2
D23
  Bottom 0.406: IC2.50 114.28,8.66 113.16,8.66 110.92,6.43 61.47,6.43 50.01,17.88 22.35,17.88 22.07,18.16 22.07,21.51 32.97,32.41 32.97,46.94 16.48,63.42 16.48,68.73 15.37,69.85 R15.2
D24
  Top 0.406: IC2.51 111.76,11.18 110.64,11.18 109.53,10.06 75.72,10.06 74.88,10.9 74.88,12.01 71.53,15.37 38.56,15.37 15.37,38.56 15.37,64.54 R16.2
D50
  Bottom 0.406: IC2.77 78.79,11.46 78.79,43.31 83.26,47.78 83.26,71.81 84.94,73.48 R23.2
D51
  Bottom 0.406: 75.58,58.53 79.91,62.87 79.91,63.42 R21.1 | 75.58,58.53 75.44,58.4 50.29,58.4 49.17,59.51 48.34,59.51 SDCARD.9 | 75.58,58.53 79.91,54.2 79.91,49.73 R26.1
D52
  Top 0.406: IC2.79 76.28,11.46 76.28,26.82 91.36,41.91 91.36,45.64 92.71,46.99 92.71,71.12 91.36,72.36 90.25,73.48 R22.2
D53
  Bottom 0.406: SDCARD.7 45.82,59.79 46.66,59.79 47.78,60.91 64.82,60.91 67.33,63.42 74.88,63.42 R20.1 75.16,63.42 75.16,59.79 R24.1
GND
  Top 0.406: R10.2 87.61,90.14 100.58,90.14 111.94,78.79 116.79,78.79 IC2.45 | IC2.4 68.73,64.54 68.73,62.31 IC2.5 68.73,62.03 77.67,62.03 R26.2 80.19,59.79 83.82,59.79 | HC-05.4 105.41,50.22 100.58,45.39 100.58,42.75 DS1307.J2.2 | 83.82,59.79 84.94,59.79 R27.2 | 83.82,59.79 83.82,63.98 84.66,64.82 85.5,64.82 89.97,60.35 89.97,59.79 R28.2 | DS18B20.1 6.43,104.22 13.97,96.67 TP8.TP 13.97,96.39 8.38,90.81 8.38,84.66 LED_RGB.P$3 8.38,84.38 11.05,84.38 16.89,78.51 20.32,75.08 20.32,72.39 21.31,71.4 24.03,71.4 24.03,66.22 BUZZER.- | LM2596.OUT- 24.03,59.23 24.03,65.94 BUZZER.- | 49.87,75.3 51.97,77.39 AD623.8 | 49.87,75.3 47.22,72.64 45.82,72.64 R19.1 | 49.87,75.3 48.34,76.83 48.34,78.23 51.97,81.86 51.97,95 AD623.1 | BUZZER.- 24.31,66.22 33.25,66.22 35.48,68.45 JP1.1 | X1.2 10.06,3.91 17.88,3.91 19,5.03 X2.3 19.28,5.03 19.84,5.03 22.78,2.08 66.9,2.08 73.48,8.66 IC2.82 73.76,8.94 73.76,11.18 IC2.81 | LM2662.1 61.19,31.85 62.87,33.53 62.87,37.44 61.19,39.12 LM2662.4 | SDCARD.15 55.88,59.79 55.04,59.79 53.92,60.91 50.29,60.91 49.45,60.07 49.45,59.23 55.32,53.37 55.88,53.37 ADS1115.2
  Bottom 0.406: SDCARD.15 55.88,59.79 66.22,59.79 68.45,62.03 IC2.5 | R26.2 81.31,58.4 81.31,48.9 80.75,48.34 79.35,48.34 78.23,49.45 75.16,49.45 R24.2 | DS1307.J2.2 100.31,42.75 100.31,46.38 90.25,56.44 90.25,59.51 R28.2 | R10.2 85.22,87.45 85.22,79.07 86.89,77.39 86.89,61.47 85.22,59.79 R27.2 | R19.1 45.54,72.36 43.03,69.85 37.72,69.85 36.6,68.73 35.76,68.73 JP1.1 35.76,68.45 35.76,62.87 38,60.63 38,59.79 SDCARD.1 38.28,59.51 39.12,59.51 44.15,54.48 54.76,54.48 55.88,53.37 ADS1115.2 55.88,44.42 60.91,39.4 LM2662.4 | IC2.81 73.48,11.46 73.48,24.31 69.85,27.94 64.82,27.94 61.19,31.57 LM2662.1
GND1  (via drill 0.35)
  Top 0.406: 19.98,8.24 21.79,6.43 22.91,6.43 24.03,5.31 X2.1 | 19.98,8.24 17.04,11.18 11.46,11.18 TP2.TP | v38,64.97 26.82,53.8 26.82,45.26 27.66,44.42 37.44,44.42 38.28,43.59 38.28,34.65 36.88,33.25 R1.2 | 19.98,8.24 23.75,12.01 23.75,19.56 LM2596.IN-
  Bottom 0.406: INDUTIVO.1 62.03,5.31 61.19,5.31 60.07,6.43 25.43,6.43 24.31,5.31 X2.1 | R1.2 36.6,32.97 36.6,32.13 24.03,19.56 LM2596.IN- | v38,64.97 41.5,64.97 51.38,74.85 73.19,74.85 R12.2
N$1
  Bottom 0.406: IC2.80 76.28,8.94 76.28,9.78 77.39,10.9 77.39,44.15 81.86,48.62 81.86,66.78 75.16,73.48 R20.2
N$2
  Top 0.406: INDUTIVO.3 57.28,5.31 57.28,9.22 62.03,13.97 R11.2
N$3
  Bottom 0.406: IC2.78 78.79,8.94 78.79,9.78 79.91,10.9 79.91,19 84.1,23.19 84.1,48.62 83.82,48.9 83.82,70.69 86.33,73.2 86.33,74.32 85.78,74.88 81.31,74.88 80.19,73.76 R21.2
N$8
  Top 0.406: TP10.TP 77.52,83.82 83.87,77.47 R10.1 85.22,77.67 89.97,77.67 R13.1 99.47,68.17 99.47,66.22 100.31,65.38 100.31,51.69 HC-05.2
N$11
  Top 0.406: R14.1 5.59,75.44 5.59,84.38 LED_RGB.P$1
N$12
  Top 0.406: LED_RGB.P$2 6.99,71.53 5.31,69.85 R15.1
N$13
  Top 0.406: LED_RGB.P$4 9.5,82.98 9.5,69.01 5.31,64.82 R16.1
N$14
  Top 0.406: SDCARD.11 50.85,59.51 51.41,59.51 57.28,53.65 57.28,52.25 58.12,51.41 60.48,51.41 62.43,49.45 66.22,49.45 67.33,48.34 83.82,48.34 84.94,49.45 R27.1
  Bottom 0.406: R22.1 89.97,63.42 89.97,61.19 85.22,56.44 85.22,49.73 R27.1
N$15
  Top 0.406: 87.61,50.85 88.85,50.85 R28.1 | 87.61,50.85 63.14,50.85 54.48,59.51 53.37,59.51 SDCARD.13 | 87.61,50.85 87.61,60.35 85.22,62.74 85.22,63.42 R23.1
N$16
  Bottom 0.406: X6.2 34.37,104.22 35.2,104.22 37.29,106.3 95.61,106.3 120.83,81.08 120.83,17.17 115.67,12.01 115.67,11.18 114.55,10.06 112.88,10.06 111.76,8.94 IC2.52
N$17
  Bottom 0.406: R17.1 79.91,77.67 76.56,77.67 75.44,78.79 29.34,78.79 24.31,73.76 BUZZER.+
N$18
  Bottom 0.406: X6.3 36.88,103.94 42.47,103.94 49.73,96.67 77.95,96.67 99.19,75.44 99.19,48.34 108.97,38.56 108.97,11.46 IC2.53
N$25
  Top 0.406: X5.1 19.28,103.94 26.54,96.67 29.06,96.67 TP12.TP 29.34,96.67 44.98,96.67 46.38,95.28 46.94,95.28 AD623.3
  Bottom 0.406: ADS1115.8 40.51,53.37 40.51,53.92 21.79,72.64 21.79,82.14 23.47,83.82 23.47,99.75 19.28,103.94 X5.1
N$26
  Top 0.406: TP11.TP 22.63,96.67 22.63,98.35 17.88,103.1 17.88,105.05 18.16,105.33 20.4,105.33 X5.2 22.91,102.82 41.35,102.82 48.9,95.28 49.45,95.28 AD623.2
  Bottom 0.406: X5.2 27.94,97.79 27.94,79.35 25.15,76.56 24.59,76.56 22.35,74.32 22.35,72.92 23.47,71.81 27.94,71.81 29.9,69.85 29.9,65.66 42.19,53.37 43.03,53.37 ADS1115.7
N$27
  Top 0.406: JP1.2 35.76,71.25 38,71.25 JP1.4
  Bottom 0.406: AD623.5 44.42,77.39 38.28,71.25 JP1.4
N$28
  Top 0.406: JP1.6 40.79,71.25 46.94,77.39 AD623.6
RX1D19
  Bottom 0.406: IC2.26 116.79,26.82 109.53,34.09 109.53,43.03 101.7,50.85 101.7,76 90.25,87.45 R13.2
SCLD21  (via drill 0.35)
  Top 0.406: DS1307.J2.5 92.76,42.47 93.6,42.47 116.79,19.28 IC2.23 | v89.41,45.82 61.75,45.82 54.48,53.09 53.37,53.09 ADS1115.3
  Bottom 0.406: v89.41,45.82 92.48,42.75 DS1307.J2.5
SDAD20  (via drill 0.35)
  Top 0.406: DS1307.J2.4 95.28,42.47 115.95,21.79 116.79,21.79 IC2.24 | v85.5,43.03 62.03,43.03 51.97,53.09 50.85,53.09 ADS1115.4
  Bottom 0.406: v85.5,43.03 87.17,41.35 93.88,41.35 95,42.47 DS1307.J2.4
TX1D18
  Bottom 0.406: HC-05.3 103.1,51.41 103.66,51.41 115.8,39.27 116.92,39.27 118.75,37.44 118.75,25.98 117.07,24.31 IC2.25
VCC1
  Top 0.406: 54.62,68.59 55.88,67.33 R18.2 | 54.62,68.59 54.48,68.73 40.79,68.73 JP1.5 | R19.2 55.88,69.85 54.62,68.59
(copper drawn outside any net)
  shapes: Top area x2